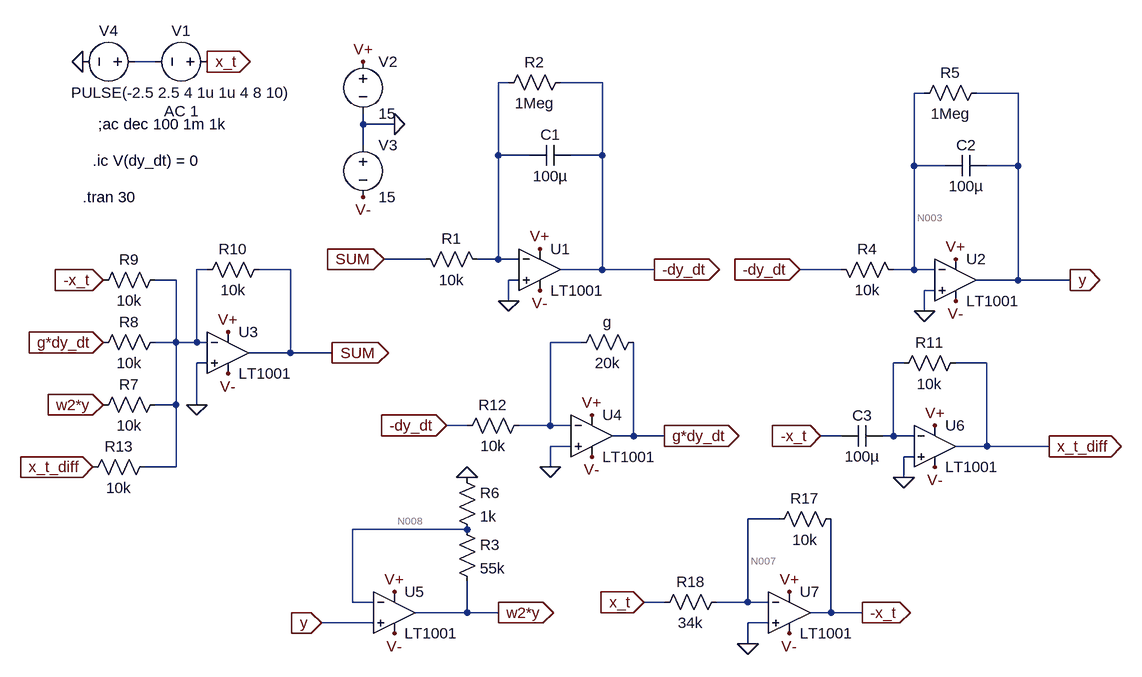
[diagram p0: schematic Analogue_Computer_FINAL_EXT.asc]
Analogue_Computer_FINAL_EXT.asc, the LTspice schematic file:
Version 4
SHEET 1 1932 1080
WIRE -512 -384 -544 -384
WIRE 32 -352 16 -352
WIRE 176 -352 112 -352
WIRE 672 -336 656 -336
WIRE 816 -336 752 -336
WIRE -192 -288 -192 -304
WIRE -144 -288 -192 -288
WIRE -192 -256 -192 -288
WIRE 16 -240 16 -352
WIRE 64 -240 16 -240
WIRE 176 -240 176 -352
WIRE 176 -240 128 -240
WIRE 656 -224 656 -336
WIRE 704 -224 656 -224
WIRE 816 -224 816 -336
WIRE 816 -224 768 -224
WIRE -96 -80 -160 -80
WIRE 16 -80 16 -240
WIRE 16 -80 -16 -80
WIRE 48 -80 16 -80
WIRE -432 -64 -448 -64
WIRE -304 -64 -352 -64
WIRE 176 -64 176 -240
WIRE 176 -64 112 -64
WIRE 256 -64 176 -64
WIRE 544 -64 480 -64
WIRE 656 -64 656 -224
WIRE 656 -64 624 -64
WIRE 688 -64 656 -64
WIRE -480 -48 -512 -48
WIRE 48 -48 32 -48
WIRE 816 -48 816 -224
WIRE 816 -48 752 -48
WIRE 896 -48 816 -48
WIRE 688 -32 672 -32
WIRE 32 -16 32 -48
WIRE 672 0 672 -32
WIRE -480 48 -480 -48
WIRE -480 48 -512 48
WIRE -448 48 -448 -64
WIRE -448 48 -480 48
WIRE -432 48 -448 48
WIRE 144 48 96 48
WIRE -304 64 -304 -64
WIRE -304 64 -368 64
WIRE -240 64 -304 64
WIRE -432 80 -448 80
WIRE 640 80 624 80
WIRE 768 80 720 80
WIRE -480 144 -480 48
WIRE -480 144 -512 144
WIRE -448 144 -448 80
WIRE -32 176 -64 176
WIRE 96 176 96 48
WIRE 96 176 48 176
WIRE 128 176 96 176
WIRE 224 192 224 48
WIRE 224 192 192 192
WIRE 272 192 224 192
WIRE 544 192 512 192
WIRE 624 192 624 80
WIRE 624 192 608 192
WIRE 656 192 624 192
WIRE 128 208 96 208
WIRE 768 208 768 80
WIRE 768 208 720 208
WIRE 864 208 768 208
WIRE 656 224 640 224
WIRE -480 240 -480 144
WIRE -480 240 -528 240
WIRE 96 240 96 208
WIRE 640 256 640 224
WIRE 448 320 400 320
WIRE -32 336 -208 336
WIRE -208 448 -208 336
WIRE -176 448 -208 448
WIRE 272 448 240 448
WIRE 400 448 400 320
WIRE 400 448 352 448
WIRE 432 448 400 448
WIRE -32 464 -32 416
WIRE -32 464 -112 464
WIRE 16 464 -32 464
WIRE 528 464 528 320
WIRE 528 464 496 464
WIRE 576 464 528 464
WIRE -176 480 -256 480
WIRE 432 480 400 480
WIRE 400 512 400 480
FLAG -144 -288 0
FLAG -192 -384 V+
FLAG -192 -176 V-
FLAG 80 -96 V+
FLAG 80 -32 V-
FLAG 256 -64 -dy_dt
IOPIN 256 -64 Out
FLAG -432 -384 x_t
IOPIN -432 -384 Out
FLAG 720 -80 V+
FLAG 720 -16 V-
FLAG 896 -48 y
IOPIN 896 -48 Out
FLAG 480 -64 -dy_dt
IOPIN 480 -64 In
FLAG -400 32 V+
FLAG -400 96 V-
FLAG -240 64 SUM
IOPIN -240 64 Out
FLAG -448 144 0
FLAG -160 -80 SUM
IOPIN -160 -80 In
FLAG 96 240 0
FLAG -64 176 -dy_dt
IOPIN -64 176 In
FLAG 272 192 g*dy_dt
IOPIN 272 192 Out
FLAG 400 512 0
FLAG 240 448 x_t
IOPIN 240 448 In
FLAG 576 464 -x_t
IOPIN 576 464 Out
FLAG -592 -48 -x_t
IOPIN -592 -48 In
FLAG -592 144 w2*y
IOPIN -592 144 In
FLAG -592 48 g*dy_dt
IOPIN -592 48 In
FLAG 464 432 V+
FLAG 160 160 V+
FLAG 464 496 V-
FLAG 160 224 V-
FLAG -624 -384 0
FLAG 32 -16 0
FLAG 672 0 0
FLAG -144 432 V+
FLAG -144 496 V-
FLAG -256 480 y
IOPIN -256 480 In
FLAG -32 256 0
FLAG 16 464 w2*y
IOPIN 16 464 Out
FLAG 688 176 V+
FLAG 688 240 V-
FLAG 640 256 0
FLAG 512 192 -x_t
IOPIN 512 192 In
FLAG 864 208 x_t_diff
IOPIN 864 208 Out
FLAG -608 240 x_t_diff
IOPIN -608 240 In
SYMBOL OpAmps\\LT1001 80 -128 R0
SYMATTR InstName U1
SYMBOL res -112 -96 M90
WINDOW 0 0 56 VBottom 2
WINDOW 3 32 56 VTop 2
SYMATTR InstName R1
SYMATTR Value 10k
SYMBOL voltage -416 -384 R90
WINDOW 0 -32 56 VBottom 2
WINDOW 3 32 56 VTop 2
WINDOW 123 60 56 VTop 2
WINDOW 39 0 0 Left 0
SYMATTR InstName V1
SYMATTR Value PULSE(-2.5 2.5 4 1u 1u 4 8 10)
SYMATTR Value2 AC 1
SYMBOL voltage -192 -400 R0
WINDOW 123 0 0 Left 0
WINDOW 39 0 0 Left 0
SYMATTR InstName V2
SYMATTR Value 15
SYMBOL voltage -192 -272 R0
WINDOW 123 0 0 Left 0
WINDOW 39 0 0 Left 0
SYMATTR InstName V3
SYMATTR Value 15
SYMBOL cap 128 -256 R90
WINDOW 0 0 32 VBottom 2
WINDOW 3 32 32 VTop 2
SYMATTR InstName C1
SYMATTR Value 100µ
SYMBOL res 128 -368 R90
WINDOW 0 0 56 VBottom 2
WINDOW 3 32 56 VTop 2
SYMATTR InstName R2
SYMATTR Value 1Meg
SYMBOL OpAmps\\LT1001 720 -112 R0
SYMATTR InstName U2
SYMBOL res 528 -80 M90
WINDOW 0 0 56 VBottom 2
WINDOW 3 32 56 VTop 2
SYMATTR InstName R4
SYMATTR Value 10k
SYMBOL cap 768 -240 R90
WINDOW 0 0 32 VBottom 2
WINDOW 3 32 32 VTop 2
SYMATTR InstName C2
SYMATTR Value 100µ
SYMBOL res 768 -352 R90
WINDOW 0 0 56 VBottom 2
WINDOW 3 32 56 VTop 2
SYMATTR InstName R5
SYMATTR Value 1Meg
SYMBOL OpAmps\\LT1001 -400 0 R0
SYMATTR InstName U3
SYMBOL res -496 128 R90
WINDOW 0 0 56 VBottom 2
WINDOW 3 32 56 VTop 2
SYMATTR InstName R7
SYMATTR Value 10k
SYMBOL res -496 32 R90
WINDOW 0 0 56 VBottom 2
WINDOW 3 32 56 VTop 2
SYMATTR InstName R8
SYMATTR Value 10k
SYMBOL res -496 -64 R90
WINDOW 0 0 56 VBottom 2
WINDOW 3 32 56 VTop 2
SYMATTR InstName R9
SYMATTR Value 10k
SYMBOL res -336 -80 R90
WINDOW 0 0 56 VBottom 2
WINDOW 3 32 56 VTop 2
SYMATTR InstName R10
SYMATTR Value 10k
SYMBOL OpAmps\\LT1001 160 128 R0
SYMATTR InstName U4
SYMBOL res 240 32 R90
WINDOW 0 0 56 VBottom 2
WINDOW 3 32 56 VTop 2
SYMATTR InstName g
SYMATTR Value 20k
SYMBOL res 64 160 R90
WINDOW 0 0 56 VBottom 2
WINDOW 3 32 56 VTop 2
SYMATTR InstName R12
SYMATTR Value 10k
SYMBOL OpAmps\\LT1001 464 400 R0
SYMATTR InstName U7
SYMBOL res 544 304 R90
WINDOW 0 0 56 VBottom 2
WINDOW 3 32 56 VTop 2
SYMATTR InstName R17
SYMATTR Value 10k
SYMBOL res 368 432 R90
WINDOW 0 0 56 VBottom 2
WINDOW 3 32 56 VTop 2
SYMATTR InstName R18
SYMATTR Value 34k
SYMBOL voltage -528 -384 R90
WINDOW 0 -32 56 VBottom 2
WINDOW 3 32 56 VTop 2
WINDOW 123 0 0 Left 0
WINDOW 39 0 0 Left 0
SYMATTR InstName V4
SYMATTR Value ""
SYMBOL OpAmps\\LT1001 -144 400 R0
SYMATTR InstName U5
SYMBOL res -48 320 R0
SYMATTR InstName R3
SYMATTR Value 55k
SYMBOL res -48 240 R0
SYMATTR InstName R6
SYMATTR Value 1k
SYMBOL OpAmps\\LT1001 688 144 R0
SYMATTR InstName U6
SYMBOL cap 608 176 R90
WINDOW 0 0 32 VBottom 2
WINDOW 3 32 32 VTop 2
SYMATTR InstName C3
SYMATTR Value 100µ
SYMBOL res 736 64 R90
WINDOW 0 0 56 VBottom 2
WINDOW 3 32 56 VTop 2
SYMATTR InstName R11
SYMATTR Value 10k
SYMBOL res -512 224 R90
WINDOW 0 0 56 VBottom 2
WINDOW 3 32 56 VTop 2
SYMATTR InstName R13
SYMATTR Value 10k
TEXT -600 -288 Left 2 !;ac dec 100 1m 1k
TEXT -608 -232 Left 2 !.ic V(dy_dt) = 0
TEXT -624 -176 Left 2 !.tran 30

The netlist it stands for:
* Analogue_Computer_FINAL_EXT.asc
XU1 0 N002 V+ V- -dy_dt LT1001  ; pins In+ In- V+ V- OUT
R1 SUM N002 10k
V1 x_t N001 PULSE(-2.5 2.5 4 1u 1u 4 8 10) AC 1
V2 V+ 0 15
V3 0 V- 15
C1 -dy_dt N002 100µ
R2 -dy_dt N002 1Meg
XU2 0 N003 V+ V- y LT1001  ; pins In+ In- V+ V- OUT
R4 -dy_dt N003 10k
C2 y N003 100µ
R5 y N003 1Meg
XU3 0 N004 V+ V- SUM LT1001  ; pins In+ In- V+ V- OUT
R7 N004 w2*y 10k
R8 N004 g*dy_dt 10k
R9 N004 -x_t 10k
R10 SUM N004 10k
XU4 0 N005 V+ V- g*dy_dt LT1001  ; pins In+ In- V+ V- OUT
R§g g*dy_dt N005 20k
R12 N005 -dy_dt 10k
XU7 0 N007 V+ V- -x_t LT1001  ; pins In+ In- V+ V- OUT
R17 -x_t N007 10k
R18 N007 x_t 34k
V4 N001 0
XU5 y N008 V+ V- w2*y LT1001  ; pins In+ In- V+ V- OUT
R3 N008 w2*y 55k
R6 0 N008 1k
XU6 0 N006 V+ V- x_t_diff LT1001  ; pins In+ In- V+ V- OUT
C3 N006 -x_t 100µ
R11 x_t_diff N006 10k
R13 N004 x_t_diff 10k
;ac dec 100 1m 1k
.ic V(dy_dt) = 0
.tran 30
.lib LTC.lib
.backanno
.end

* Results of the author's LTspice run, read from the files saved beside the schematic
* Operating Point, zero values left out:
*   V(v+) = 15 V
*   V(v-) = -15 V
*   V(-dy_dt) = 131.3 µV
*   V(sum) = -1.313 µV
*   V(x_t) = -2.5 V
*   V(n003) = 17.59 nV
*   V(y) = -13.13 mV
*   V(w2*y) = -735 mV
*   V(g*dy_dt) = -262.6 µV
*   V(-x_t) = 735.3 mV
*   V(n007) = -991.8 nV
*   V(n008) = -13.13 mV
*   I(R6) = 13.13 µA
*   I(R3) = 13.13 µA
*   I(R18) = 73.53 µA
*   I(R17) = 73.53 µA
*   I(R12) = -13.13 nA
*   I(G) = -13.13 nA
*   I(R10) = -131.3 pA
*   I(R9) = -73.53 µA
*   I(R8) = 26.26 nA
*   I(R7) = 73.5 µA
*   I(R5) = -13.13 nA
*   I(R4) = 13.13 nA
*   I(R2) = 131.3 pA
*   I(R1) = -131.3 pA
*   I(V4) = 73.53 µA
*   I(V3) = -15.72 mA
*   I(V2) = -15.78 mA
*   I(V1) = 73.53 µA